# Altium schematic sheet PCBA-2075-02.SchDoc
size Tabloid; Organization: Hebi Robotics; Address1: Suite 780; Address2: 5001 Baum Blvd; Address3: Pittsburgh, PA 15213; Address4: USA
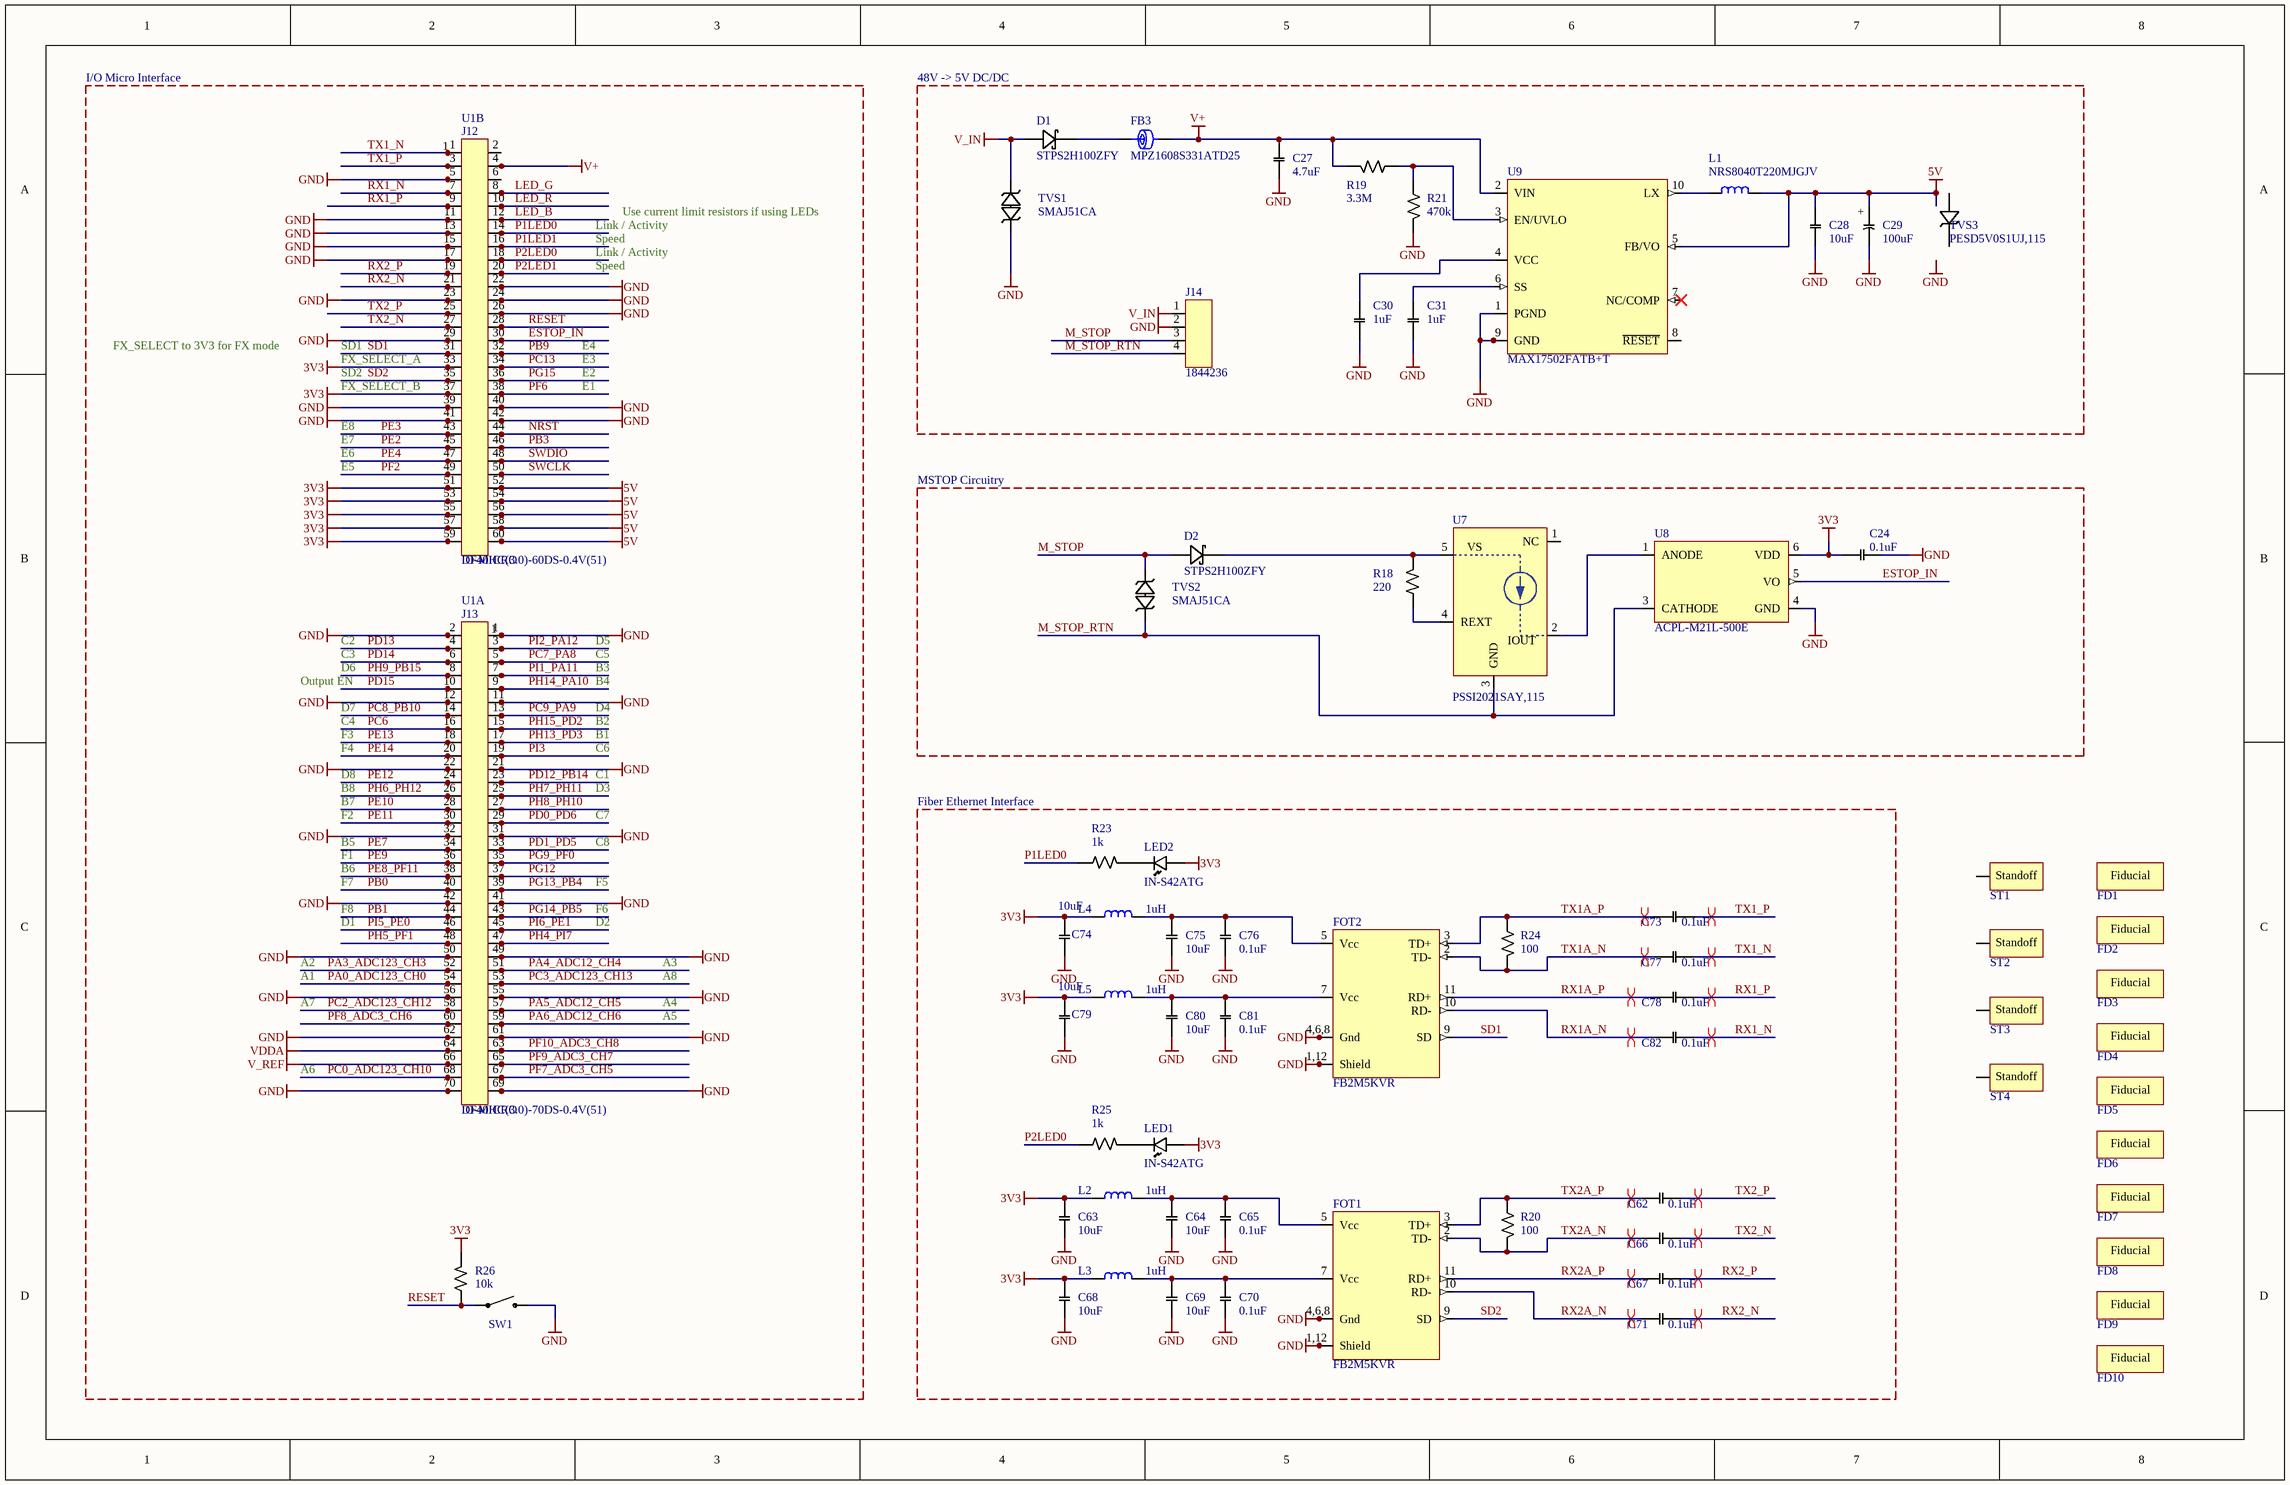
[diagram p0: PCBA-2075-02.SchDoc]

## Parts
C24  Capacitance: 0.1uF  [C0402]  (hidden comment: CMP-00040-11)
C27  Capacitance: 4.7uF  [C1210]  (hidden comment: C-4.7uf-X7S-100V-20%-1210)
C28  Capacitance: 10uF  [C0603]  (hidden comment: C-10uf-X5R-16V-10%-0603)
C29  Capacitance: 100uF  [CAPAE127P600-8N]  (hidden comment: 16SVPC100M)
C30  Capacitance: 1uF  [C0603]  (hidden comment: C-1uf-X7R-25V-10%-0603)
C31  Capacitance: 1uF  [C0603]  (hidden comment: C-1uf-X7R-25V-10%-0603)
C62  Capacitance: 0.1uF  [C0402]  (hidden comment: CMP-00040-11)
C63  Capacitance: 10uF  [C0603]  (hidden comment: C-10uf-X5R-16V-10%-0603)
C64  Capacitance: 10uF  [C0603]  (hidden comment: C-10uf-X5R-16V-10%-0603)
C65  Capacitance: 0.1uF  [C0402]  (hidden comment: CMP-00040-11)
C66  Capacitance: 0.1uF  [C0402]  (hidden comment: CMP-00040-11)
C67  Capacitance: 0.1uF  [C0402]  (hidden comment: CMP-00040-11)
C68  Capacitance: 10uF  [C0603]  (hidden comment: C-10uf-X5R-16V-10%-0603)
C69  Capacitance: 10uF  [C0603]  (hidden comment: C-10uf-X5R-16V-10%-0603)
C70  Capacitance: 0.1uF  [C0402]  (hidden comment: CMP-00040-11)
C71  Capacitance: 0.1uF  [C0402]  (hidden comment: CMP-00040-11)
C73  Capacitance: 0.1uF  [C0402]  (hidden comment: CMP-00040-11)
C74  Capacitance: 10uF  [C0603]  (hidden comment: C-10uf-X5R-16V-10%-0603)
C75  Capacitance: 10uF  [C0603]  (hidden comment: C-10uf-X5R-16V-10%-0603)
C76  Capacitance: 0.1uF  [C0402]  (hidden comment: CMP-00040-11)
C77  Capacitance: 0.1uF  [C0402]  (hidden comment: CMP-00040-11)
C78  Capacitance: 0.1uF  [C0402]  (hidden comment: CMP-00040-11)
C79  Capacitance: 10uF  [C0603]  (hidden comment: C-10uf-X5R-16V-10%-0603)
C80  Capacitance: 10uF  [C0603]  (hidden comment: C-10uf-X5R-16V-10%-0603)
C81  Capacitance: 0.1uF  [C0402]  (hidden comment: CMP-00040-11)
C82  Capacitance: 0.1uF  [C0402]  (hidden comment: CMP-00040-11)
D1  STPS2H100ZFY  [SOD123F_ST]
D2  STPS2H100ZFY  [SOD123F_ST]
FB3  MPZ1608S331ATD25  [FB0603]
FD1  FIDUCIAL  [fiducial_01]  (value not drawn)  (no BOM)
FD2  FIDUCIAL  [fiducial_01]  (value not drawn)  (no BOM)
FD3  FIDUCIAL  [fiducial_01]  (value not drawn)  (no BOM)
FD4  FIDUCIAL  [fiducial_01]  (value not drawn)  (no BOM)
FD5  *  [fiducial_01_no_overlay]  (value not drawn)  (no BOM)
FD6  *  [fiducial_01_no_overlay]  (value not drawn)  (no BOM)
FD7  *  [fiducial_01_no_overlay]  (value not drawn)  (no BOM)
FD8  *  [fiducial_01_no_overlay]  (value not drawn)  (no BOM)
FD9  *  [fiducial_01_no_overlay]  (value not drawn)  (no BOM)
FD10  *  [fiducial_01_no_overlay]  (value not drawn)  (no BOM)
FOT1  FB2M5KVR  [OPTOLOCK]
FOT2  FB2M5KVR  [OPTOLOCK]
J12  DF40HC(3.0)-60DS-0.4V(51)  [DF40HC(3.0)-60DS-0.4V(51)]
J13  DF40HC(3.0)-70DS-0.4V(51)  [DF40HC(3.0)-70DS-0.4V(51)]
J14  1844236  [1844236]
L1  NRS8040T220MJGJV  [NR8040T220M]
L2  Inductance: 1uH  [I0603]  (hidden comment: ASMPH-0603-1R0M-T)
L3  Inductance: 1uH  [I0603]  (hidden comment: ASMPH-0603-1R0M-T)
L4  Inductance: 1uH  [I0603]  (hidden comment: ASMPH-0603-1R0M-T)
L5  Inductance: 1uH  [I0603]  (hidden comment: ASMPH-0603-1R0M-T)
LED1  IN-S42ATG  [IN-S42AT]
LED2  IN-S42ATG  [IN-S42AT]
R18  Resistance: 220  [R0603]  (hidden comment: R-220-1%-0.25w-0603)
R19  Resistance: 3.3M  [R0402]  (hidden comment: R-3.3M-1%-0.063w-0402)
R20  value 100  [R0402]  (hidden comment: R-100-1%-0.063w-0402)
R21  Resistance: 470k  [R0402]  (hidden comment: R-470k-1%-0.063w-0402)
R23  Resistance: 1k  [R0402]  (hidden comment: R-1k-1%-0.063w-0402)
R24  value 100  [R0402]  (hidden comment: R-100-1%-0.063w-0402)
R25  Resistance: 1k  [R0402]  (hidden comment: R-1k-1%-0.063w-0402)
R26  Resistance: 10k  [R0402]  (hidden comment: R-10k-1%-0.063w-0402)
ST1  9774030960R  [9774030960R]  (value not drawn)
ST2  9774030960R  [9774030960R]  (value not drawn)
ST3  9774030960R  [9774030960R]  (value not drawn)
ST4  9774030960R  [9774030960R]  (value not drawn)
SW1  222ADVBA  [222ADVBA]  (value not drawn)
TVS1  SMAJ51CA  [SMA_BI_BOURNS]
TVS2  SMAJ51CA  [SMA_BI_BOURNS]
TVS3  PESD5V0S1UJ,115  [SOD-323F_NXP]
U1  IO-MICRO  [IO-MICRO-Footprint-1]  (parts A,B of 2)  (no BOM)
U7  PSSI2021SAY,115  [PSSI2021SAY,115]
U8  ACPL-M21L-500E  [SOT125P700X260-5N]
U9  MAX17502FATB+T  [10_TDFN_MAXIM]

## Blocks framed on the sheet
48V -> 5V DC/DC: C27-C31 D1 FB3 J14 L1 R19 R21 TVS1 TVS3 U9
MSTOP Circuitry: C24 D2 R18 TVS2 U7 U8
Fiber Ethernet Interface: C62-C71 C73-C82 FOT1 FOT2 L2-L5 LED1 LED2 R20 R23-R25

## Nets
3V3: C24.1 C63.2 C68.2 C74.2 C79.2 J12.33 J12.37 J12.51 J12.53 J12.55 J12.57 J12.59 L2.1 L3.1 L4.1 L5.1 LED1.A LED2.A R26.2 U1.B33 U1.B37 U1.B51 U1.B53 U1.B55 U1.B57 U1.B59 U8.6(VDD)
5V: C28.2 C29.+ J12.52 J12.54 J12.56 J12.58 J12.60 L1.2 U1.B52 U1.B54 U1.B56 U1.B58 U1.B60 U9.5(FB/VO)
GND: C24.2 C27.1 C28.1 C29.- C30.2 C31.2 C63.1 C64.1 C65.1 C68.1 C69.1 C70.2 C74.1 C75.1 C76.1 C79.1 C80.1 C81.2 FOT1.1(Shield) FOT1.4(Gnd) FOT1.6(Gnd) FOT1.8(Gnd) FOT1.12(Shield) FOT2.1(Shield) FOT2.4(Gnd) FOT2.6(Gnd) FOT2.8(Gnd) FOT2.12(Shield) J12.5 J12.11 J12.13 J12.15 J12.17 J12.22 J12.23 J12.24 J12.26 J12.29 J12.39 J12.40 J12.41 J12.42 J13.1 J13.2 J13.11 J13.12 J13.21 J13.22 J13.31 J13.32 J13.41 J13.42 J13.49 J13.50 J13.55 J13.56 J13.61 J13.62 J13.69 J13.70 J14.2 R21.2 SW1.2 TVS1.A U1.A1 U1.A2 U1.A11 U1.A12 U1.A21 U1.A22 U1.A31 U1.A32 U1.A41 U1.A42 U1.A49 U1.A50 U1.A55 U1.A56 U1.A61 U1.A62 U1.A69 U1.A70 U1.B5 U1.B11 U1.B13 U1.B15 U1.B17 U1.B22 U1.B23 U1.B24 U1.B26 U1.B29 U1.B39 U1.B40 U1.B41 U1.B42 U8.4(GND) U9.1(PGND) U9.9(GND) U9.11(GND)
V+: C27.2 FB3.2 J12.4 R19.2 U1.B4 U9.2(VIN)
V_IN: D1.A J14.1 TVS1.C
V_REF: J13.66 U1.A66
VDDA: J13.64 U1.A64
ESTOP_IN: J12.30 U1.B30 U8.5(VO)
LED_B: J12.12 U1.B12
LED_G: J12.8 U1.B8
LED_R: J12.10 U1.B10
M_STOP: D2.A J14.3 TVS2.C
M_STOP_RTN: J14.4 TVS2.A U7.3(GND) U8.3(CATHODE)
NRST: J12.44 U1.B44
P1LED0: J12.14 R23.1 U1.B14
P1LED1: J12.16 U1.B16
P2LED0: J12.18 R25.1 U1.B18
P2LED1: J12.20 U1.B20
PA0_ADC123_CH0: J13.54 U1.A54
PA3_ADC123_CH3: J13.52 U1.A52
PA4_ADC12_CH4: J13.51 U1.A51
PA5_ADC12_CH5: J13.57 U1.A57
PA6_ADC12_CH6: J13.59 U1.A59
PB0: J13.40 U1.A40
PB1: J13.44 U1.A44
PB3: J12.46 U1.B46
PB9: J12.32 U1.B32
PC0_ADC123_CH10: J13.68 U1.A68
PC2_ADC123_CH12: J13.58 U1.A58
PC3_ADC123_CH13: J13.53 U1.A53
PC6: J13.16 U1.A16
PC7_PA8: J13.5 U1.A5
PC8_PB10: J13.14 U1.A14
PC9_PA9: J13.13 U1.A13
PC13: J12.34 U1.B34
PD0_PD6: J13.29 U1.A29
PD1_PD5: J13.33 U1.A33
PD12_PB14: J13.23 U1.A23
PD13: J13.4 U1.A4
PD14: J13.6 U1.A6
PD15: J13.10 U1.A10
PE2: J12.45 U1.B45
PE3: J12.43 U1.B43
PE4: J12.47 U1.B47
PE7: J13.34 U1.A34
PE8_PF11: J13.38 U1.A38
PE9: J13.36 U1.A36
PE10: J13.28 U1.A28
PE11: J13.30 U1.A30
PE12: J13.24 U1.A24
PE13: J13.18 U1.A18
PE14: J13.20 U1.A20
PF2: J12.49 U1.B49
PF6: J12.38 U1.B38
PF7_ADC3_CH5: J13.67 U1.A67
PF8_ADC3_CH6: J13.60 U1.A60
PF9_ADC3_CH7: J13.65 U1.A65
PF10_ADC3_CH8: J13.63 U1.A63
PG9_PF0: J13.35 U1.A35
PG12: J13.37 U1.A37
PG13_PB4: J13.39 U1.A39
PG14_PB5: J13.43 U1.A43
PG15: J12.36 U1.B36
PH4_PI7: J13.47 U1.A47
PH5_PF1: J13.48 U1.A48
PH6_PH12: J13.26 U1.A26
PH7_PH11: J13.25 U1.A25
PH8_PH10: J13.27 U1.A27
PH9_PB15: J13.8 U1.A8
PH13_PD3: J13.17 U1.A17
PH14_PA10: J13.9 U1.A9
PH15_PD2: J13.15 U1.A15
PI1_PA11: J13.7 U1.A7
PI2_PA12: J13.3 U1.A3
PI3: J13.19 U1.A19
PI5_PE0: J13.46 U1.A46
PI6_PE1: J13.45 U1.A45
RESET: J12.28 R26.1 SW1.1 U1.B28
RX1_N: C82.2 J12.7 U1.B7
RX1_P: C78.2 J12.9 U1.B9
RX1A_N: C82.1 FOT2.10(RD-)
RX1A_P: C78.1 FOT2.11(RD+)
RX2_N: C71.1 J12.21 U1.B21
RX2_P: C67.1 J12.19 U1.B19
RX2A_N: C71.2 FOT1.10(RD-)
RX2A_P: C67.2 FOT1.11(RD+)
SD1: FOT2.9(SD) J12.31 U1.B31
SD2: FOT1.9(SD) J12.35 U1.B35
SWCLK: J12.50 U1.B50
SWDIO: J12.48 U1.B48
TX1_N: C77.2 J12.1 U1.B1
TX1_P: C73.2 J12.3 U1.B3
TX1A_N: C77.1 FOT2.2(TD-) R24.2
TX1A_P: C73.1 FOT2.3(TD+) R24.1
TX2_N: C66.1 J12.27 U1.B27
TX2_P: C62.1 J12.25 U1.B25
TX2A_N: C66.2 FOT1.2(TD-) R20.2
TX2A_P: C62.2 FOT1.3(TD+) R20.1
NetC30_1: C30.1 U9.4(VCC)
NetC31_1: C31.1 U9.6(SS)
NetC64_2: C64.2 C65.2 FOT1.5(Vcc) L2.2
NetC69_2: C69.2 C70.1 FOT1.7(Vcc) L3.2
NetC75_2: C75.2 C76.2 FOT2.5(Vcc) L4.2
NetC80_2: C80.2 C81.1 FOT2.7(Vcc) L5.2
NetD1_C: D1.C FB3.1
NetD2_C: D2.C R18.2 U7.5(VS)
NetJ12_2: J12.2 U1.B2
NetJ12_6: J12.6 U1.B6
NetL1_1: L1.1 U9.10(LX)
NetLED1_C: LED1.C R25.2
NetLED2_C: LED2.C R23.2
NetR18_1: R18.1 U7.4(REXT)
NetR19_1: R19.1 R21.1 U9.3(EN/UVLO)
NetU7_2: U7.2(IOUT) U8.1(ANODE)

Not connected (* = marked no-connect by the designer): ST1 1; ST2 1; ST3 1; ST4 1; TVS3 A C; U7 1(NC); U9 7(NC/COMP)* 8(~{RESET})

## Layout directives
differential pair: RX1_N, RX1_P, RX1A_N, RX1A_P, RX2_N, RX2_P, RX2A_N, RX2A_P, TX1_N, TX1_P, TX1A_N, TX1A_P, TX2_N, TX2_P, TX2A_N, TX2A_P

## Notes on the sheet
- I/O Micro Interface
- Link / Activity
- Use current limit resistors if using LEDs
- Speed
- FX_SELECT to 3V3 for FX mode
- SD1
- FX_SELECT_A
- E3
- E4
- SD2
- FX_SELECT_B
- E8
- E1
- E2
- E5
- E6
- E7
- Output EN
- C2
- C3
- D6
- B3
- B4
- C5
- D5
- C4
- D7
- F4
- F3
- B1
- B2
- C6
- D4
- B7
- B8
- D8
- F2
- C1
- C7
- D3
- B5
- B6
- F7
- F1
- C8
- F5
- A2
- D1
- F8
- D2
- F6
- A3
- A1
- A7
- A4
- A5
- A8
- A6
- Labels drawn without touching a wire or pin: GND
- Title
- Size:
- Date:
- Tabloid
- Number:
- Time:
- Revision:
- Sheet
- of
- File:
- (in symbol CMP-504-0002-4) Standoff
- (in symbol CMP-1167-0000-7) 4,6,8; 1,12
- (in symbol fiducial_01_no_overlay) Fiducial

## Library data of the parts
C24 C62 C65-C67 C70 C71 C73 C76-C78 C81 C82 = CMP-00040-11: Capacitor Ceramic 0.1uF 25V X7R 10% SMD 0402; Tolerance: 10%; Voltage - Rated: 25V; Temperature Coefficient: X7R; Package / Case: 0402; Operating Temperature: -55°C ~ 125°C
C27 = C-4.7uf-X7S-100V-20%-1210-6: Capacitor Ceramic 4.7uF 100V X7S 20% SMD 1210; Tolerance: ±20%; Voltage - Rated: 100V; Temperature Coefficient: X7S; Package / Case: 1210; Operating Temperature: -55°C ~ 125°C
C28 C63 C64 C68 C69 C74 C75 C79 C80 = CMP-00102-2: Capacitor Ceramic 10uF 16V X5R 10% SMD 0603; Tolerance: 10%; Voltage - Rated: 16V; Temperature Coefficient: X5R; Operating Temperature: -55°C ~ 85°C; Package / Case: 0603
C29 = CMP-00071-2: CAP ALUM POLY 100UF 20% 16V SMD; Ripple Current: 2.49A; Dissipation Factor: 12%; ESR (Equivalent Series Resistance): 24mR; Leakage Current: 300uA; Life (Hours): 2000Hour; Polarity: Polar; Tolerance: 20%; Voltage Rating: 16V; Height - Seated (Max): 0.236inch; Case/Package: Radial; Diameter: 6.3mm; Height: 5.9mm; Lead Free: Lead Free; Length: 5.9mm; Max Operating Temperature: 105°C; Min Operating Temperature: -55°C; Mount: Surface Mount; Number of Pins: 6; Package Quantity: 1000; Packaging: Tape and Reel; Radiation Hardening: No; REACH SVHC: No SVHC; Ripple Current (AC): 2.49A; Termination: SMD/SMT; Voltage: 16V; Voltage Rating (DC): 16V
C30 C31 = CMP-00057-3: Capacitor Ceramic 1uF 25V X7R 10% SMD 0603; Tolerance: 10%; Voltage - Rated: 25V; Temperature Coefficient: X7R; Operating Temperature: -55°C ~ 125°C; Package / Case: 0603
D1 D2 = CMP-698-0009-4: DIODE SCHOTTKY 100V 2A SOD123F; Voltage - Forward (Vf) (Max) @ If: 960mV @ 4A; Speed: Fast Recovery =< 500ns, > 200mA (Io); Current - Reverse Leakage @ Vr: 1µA @ 100V; Lead Free Status / RoHS Status: RoHS Compliant; ComponentLink1Description: Datasheet; ComponentLink1URL: http://www.st.com/content/ccc/resource/technical/document/datasheet/group3/ee/fd/cc/9a/a8/bc/46/dd/DM00306086/files/DM00306086.pdf/jcr:content/translations/en.DM00306086.pdf; Category: Discrete Semiconductor Products; Diode Type: Schottky; Voltage - DC Reverse (Vr) (Max): 100V; Current - Average Rectified (Io): 2A; Capacitance @ Vr, F: -; Mounting Type: Surface Mount; Package / Case: SOD-123F; Supplier Device Package: SOD-123F; Operating Temperature - Junction: -40°C ~ 175°C; Part Status: Active; Packaging: Cut Tape (CT)
FB3 = CMP-00231-5: FERRITE CHIP 330 OHM 1.7A 0603; DC Resistance (DCR): 80 mOhm Max; Lead Free Status / RoHS Status: RoHS Compliant; ComponentLink1Description: Datasheet; ComponentLink1URL: http://product.tdk.com/en/catalog/datasheets/beads_automotive_power_mpz_en.pdf; Category: Filters; Filter Type: -; Package / Case: 0603 (1608 Metric); Mounting Type: Surface Mount; Height (Max): 0.037" (0.95mm); Size / Dimension: 0.063" L x 0.031" W (1.60mm x 0.80mm); Current Rating: 1.7A
FD1-FD4 = fiducial_01: Manufacturer Part Number: fiducial_01
FD5-FD10 = fiducial_01_no_overlay: Fiducial with no overlay; Manufacturer Part Number: fiducial_01_no_overlay
FOT1 FOT2 = CMP-1167-0000-7: Industrial Ethernet Fiber Optic; Manufacturer: Firecomms; Data Rate: 250Mbps; Wavelength: 650nm; Voltage - Supply: 3.3V; Manufacturer Part Number: FB2M5KVR; Lead Free Status / RoHS Status: RoHS Compliant; Category: Optoelectronics; Part Status: Active; Applications: Fast Ethernet; Connector Type: Optolock; Mounting Type: Through Hole; ComponentLink1URL: https://store.fiberfin.com/media/custom/upload/File-1498839817.pdf; ComponentLink1Description: Datasheet
J12 = CMP-00492-3: CONN RCPT 60POS 0.4MM SMD GOLD; Connector Type: Receptacle; Mated Stacking Heights: 3mm; Number of Contacts: 60; Pitch: 0.016inch; Manufacturer Part Number: DF40HC(3.0)-60DS-0.4V(51); Case/Package: Metal; Contact Material: Bronze; Contact Plating: Gold; Gender: Receptacle; Mount: Surface Mount; Number of Positions: 60; Number of Rows: 2; Package Quantity: 3000; Packaging: Tape and Reel; REACH SVHC: No SVHC; Stack Height: 3mm; Termination: SMD/SMT
J13 = CMP-00491-1: CONN RCPT 70POS 0.4MM SMD GOLD; Manufacturer: Hirose; Manufacturer Part Number: DF40HC(3.0)-70DS-0.4V(51); Lead Free Status / RoHS Status: RoHS Compliant; ComponentLink1Description: Datasheet; ComponentLink1URL: https://www.hirose.com/product/document?clcode=CL0684-4003-3-51&productname=DF40C-60DP-0.4V(51)&series=DF40&documenttype=Catalog&lang=en&documentid=D31649_en
J14 = CMP-1158-0000-1: HEADER TERM BLOCK 3.5MM 4POS; Manufacturer: Phoenix Contact; Manufacturer Part Number: 1844236
L1 = CMP-00359-2: FIXED IND 22UH 2.2A 85.8 MOHM; Type: Wirewound; Tolerance: ±20%; Shielding: Shielded; DC Resistance (DCR): 85.8 mOhm Max; Material - Core: Ferrite; Lead Free Status / RoHS Status: RoHS Compliant; ComponentLink1Description: Datasheet; ComponentLink1URL: http://ds.yuden.co.jp/TYCOMPAS/ut/detail.do?productNo=NRS8040T220MJGJV&fileName=NRS8040T220MJGJV_SS&mode=specSheetDownload; Category: Inductors, Coils, Chokes; Operating Temperature: -40°C ~ 125°C; Mounting Type: Surface Mount; Package / Case: Nonstandard; Size / Dimension: 0.315" L x 0.315" W (8.00mm x 8.00mm); Height - Seated (Max): 0.165" (4.20mm); Q @ Freq: -; Supplier Device Package: -; Ratings: AEC-Q200; Part Status: Active
L2-L5 = CMP-00368-3: FIXED IND 1UH 1A 200 MOHM SMD; DC Resistance (DCR): 200mR; Tolerance: 20%; Shielding: Shielded; Case/Size Code: 0603; Core Material: Ferrite; Inductor Application: POWER INDUCTOR; Inductor Type: GENERAL PURPOSE INDUCTOR; Number of Functions: 1; Number of Terminals/Pins: 2; Self Resonant Frequency: 125MHz; Shape/Size Description: RECTANGULAR PACKAGE; Test Frequency: 1MHz; ComponentLink1URL: https://abracon.com/Magnetics/power/ASMPH-0603.pdf; ComponentLink1Description: Datasheet; JESD-609 Code: e3; Max Operating Temperature: 85°C; Min Operating Temperature: -40°C; Rated Current-Max: 1A; REACH SVHC: Yes; RoHS Compliant: Yes; Surface Mount: Yes; Terminal Finish: Nickel; Terminal Placement: Dual Ended; Termination: Wraparound
LED1 LED2 = CMP-00249-2: LED GREEN CLEAR 0402 SMD; Dominant Wavelength: 525nm; Forward Voltage: 3.3V; Lens Size: 0.45mm; Lens Style: Flat; Luminous Intensity: 450mcd; Test Current: 20mA; Viewing Angle: 130°; Case/Package: 0402; Case Code (Imperial): 0402; Case Code (Metric): 1005; Color: Green; Height: 0.55mm; Length: 1mm; Lens Color: Clear; Lens Transparency: Clear; Mount: Surface Mount; Packaging: Cut Tape; Width: 0.5mm
R18 = CMP-00175-3: Resistor 0603 220 Ohm 1% 1-4 Watt; Power: 0.25W, 1/4W; Part Name: R-220-1%-0.25w-0603; Tolerance (%): ±1%; Package / Case: 0603
R19 = CMP-00141-5: Resistor 0402 3.3M Ohm 1% 1-16 Watt; Power: 0.063W, 1/16W; Package / Case: 0402; Tolerance (%): ±1%
R20 R24 = CMP-00022-6: Resistor 0402 100 Ohm 1% 1-16 Watt; Power: 0.063W, 1/16W; Package: 0402; Resistance: 100; Tolerance: 1%
R21 = CMP-00804-1: Resistor 0402 470k Ohm 1% 1-16 Watt; Power: 0.063W, 1/16W; Package: 0402; Tolerance: 1%
R23 R25 = CMP-00012-5: Resistor 0402 1k Ohm 1% 1-16 Watt; Power: 0.063W, 1/16W; Package: 0402; Tolerance: 1%
R26 = CMP-00015-10: Resistor 0402 10k Ohm 1% 1-16 Watt; Power: 0.063W, 1/16W; Package: 0402; Tolerance: 1%
ST1-ST4 = CMP-504-0002-4: ROUND SPACER M3.3 STEEL 3MM; Manufacturer: Wurth Electronics Inc; Threaded/Unthreaded: Unthreaded; Between Board Height: 0.118" (3.00mm); Plating: Tin; Manufacturer Part Number: 9774030960R; Lead Free Status / RoHS Status: RoHS Compliant; ComponentLink1Description: Datasheet; ComponentLink1URL: http://katalog.we-online.de/em/datasheet/9774030960R.pdf; Category: Hardware, Fasteners, Accessories; Type: Round Spacer; Gender: -; Screw, Thread Size: M3.3; Diameter - Inside: 0.130" (3.30mm); Diameter - Outside: 0.236" (6.00mm); Length - Overall: 0.173" (4.39mm); Features: Surface Mount; Material: Steel; Color: -; Weight: -
SW1 = CMP-00538-1: Tactile Switch SPST-NO Top Actuated Through Hole; Manufacturer: CTS; Switch Function: Off-Mom; Actuator Type: Standard; Operating Force: 160gf; Switch Travel: 0.25mm; Mechanical Life: 1000000Cycles; Throw Configuration: SPST; Illumination Type: Non-Illuminated; Manufacturer Part Number: 222ADVBA; Lead Free Status / RoHS Status: RoHS Compliant; ComponentLink1Description: Datasheet; ComponentLink1URL: https://www.ctscorp.com/wp-content/uploads/222A.pdf; Mount: Through Hole; Min Operating Temperature: -40°C; Max Operating Temperature: 85°C; Termination: PC Pin
TVS1 TVS2 = CMP-00457-4: TVS DIODE 51VWM 82.4VC DO214AC; Voltage - Reverse Standoff (Typ): 51V; Voltage - Breakdown (Min): 56.7V; Voltage - Clamping (Max) @ Ipp: 82.4V; Current - Peak Pulse (10/1000µs): 4.9A; Power - Peak Pulse: 400W; Power Line Protection: No; Bidirectional Channels: 1; Lead Free Status / RoHS Status: RoHS Compliant; ComponentLink1Description: Datasheet; ComponentLink1URL: http://www.bourns.com/docs/Product-Datasheets/SMAJ.pdf; Category: Circuit Protection; Type: Zener; Applications: General Purpose; Capacitance @ Frequency: -; Operating Temperature: -55°C ~ 150°C (TJ); Mounting Type: Surface Mount; Package / Case: DO-214AC, SMA; Supplier Device Package: SMA (DO-214AC); Part Status: Active; Packaging: Cut Tape (CT)
TVS3 = CMP-00446-3: TVS DIODE 5VWM 19VC SOD323F; Unidirectional Channels: 1; Voltage - Reverse Standoff (Typ): 5V (Max); Voltage - Breakdown (Min): 6.2V; Voltage - Clamping (Max) @ Ipp: 19V; Current - Peak Pulse (10/1000µs): 47A (8/20µs); Power - Peak Pulse: 890W; Power Line Protection: No; Capacitance @ Frequency: 480pF @ 1MHz; Lead Free Status / RoHS Status: RoHS Compliant; ComponentLink1Description: Datasheet; ComponentLink1URL: http://www.nxp.com/documents/data_sheet/PESD5V0S1UJ_PESD12VS1UJ.pdf; Category: Circuit Protection; Type: Zener; Bidirectional Channels: -; Applications: Automotive; Operating Temperature: -55°C ~ 150°C (TA); Mounting Type: Surface Mount; Package / Case: SC-90, SOD-323F; Supplier Device Package: SOD-323F
U1 = CMP-00789-8: IO Micro Composite Component; PartId: 1
U7 = CMP-631-0001-3: Current Source Regulator  50mA 5-TSSOP; Input Current: 240uA; Max Power Dissipation: 335mW; Max Supply Voltage: 75V; Polarity: PNP; Case/Package: SOT-353; Height: 1mm; Lead Free: Lead Free; Length: 2.2mm; Max Operating Temperature: 150°C; Min Operating Temperature: -65°C; Mount: Surface Mount; Number of Pins: 5; Output Current: 50mA; Package Quantity: 1; Packaging: Tape and Reel; Power Dissipation: 335mW; Radiation Hardening: No; REACH SVHC: No SVHC; Series: -; Termination: SMD/SMT; Weight: 0.001lb; Width: 1.35mm
U8 = CMP-636-0002-3: OPTOISO 3.75KV PUSH PULL 5SO; Number of Channels: 1; Input Type: DC; Output Type: PUSH-PULL; Direction: Unidirectional; Fall Time: 11ns; Forward Current: 2.2mA; Forward Voltage: 1.5V; Input Current: 6mA; Max Input Current: 8mA; Max Output Current: 10mA; Max Power Dissipation: 600mW; Propagation Delay: 250ns; Reverse Breakdown Voltage: 5V; Case/Package: SO; Isolation Voltage: 3.75kV; Max Operating Temperature: 105°C; Min Operating Temperature: -40°C; Mount: Surface Mount; Number of Elements: 1; Number of Pins: 5; Output Current: 10mA; Output Current per Channel: 10mA; Package Quantity: 1500; Packaging: Tape and Reel; Power Dissipation: 600mW; Radiation Hardening: No; REACH SVHC: No SVHC; Rise Time: 11ns; Series: -; Turn-On Delay Time: 250ns
U9 = CMP-452-0001-3: IC REG BUCK 5V 1A SYNC 10TDFN; Manufacturer: Maxim Integrated; Output Type: Fixed; Number of Outputs: 1; Frequency - Switching: 600kHz; Synchronous Rectifier: Yes; Function: Step-Down; Output Configuration: Positive; Voltage - Input (Min): 4.5V; Voltage - Input (Max): 60V; Manufacturer Part Number: MAX17502FATB+T; Lead Free Status / RoHS Status: RoHS Compliant; ComponentLink1Description: Datasheet; ComponentLink1URL: http://datasheets.maximintegrated.com/en/ds/MAX17502.pdf; Category: Integrated Circuits (ICs); Current - Output: 1A; Operating Temperature: -40°C ~ 125°C (TJ); Mounting Type: Surface Mount; Package / Case: 10-WFDFN Exposed Pad; Supplier Device Package: 10-TDFN (3x2); Topology: Buck; Voltage - Output (Min/Fixed): 5V; Voltage - Output (Max): -; Part Status: Active; Packaging: Cut Tape (CT)